# Altium schematic sheet Soldeerbout_P2.SchDoc: Soldeerbout
size A4; DrawnBy: Boghe Tim; Revision: 01; SheetNumber: 2; SheetTotal: 5; Number: PXL2022-0001
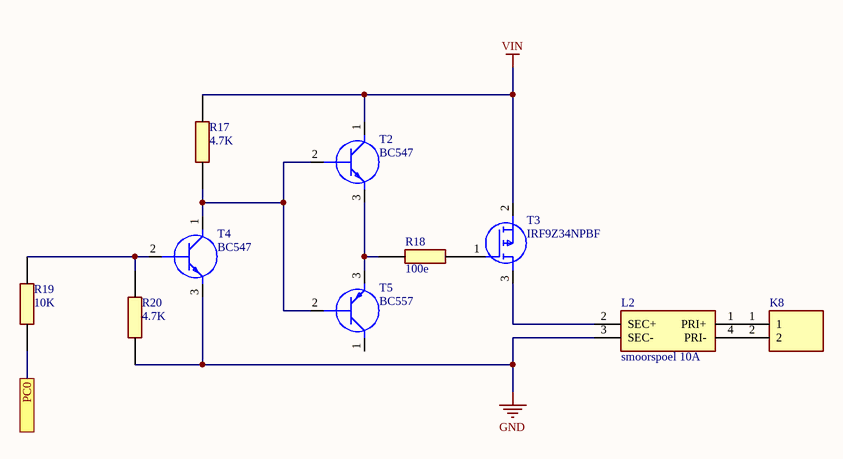
[diagram p0: Soldeerbout_P2.SchDoc]

## Parts
K8  (no value)  [K printkroonsteen 5.08]
L2  smoorspoel 10A  [CM smoorspoelen/filters 170ohm 100Mhz 10A]
R17  4.7K  [0805]
R18  100e  [0805]
R19  10K  [0805]
R20  4.7K  [0805]
T2  BC547  [T1,2,4 BC547C 45V 100mA]
T3  IRF9Z34NPBF  [T3 P-mosfet 55V 17A 0.1e]
T4  BC547  [T1,2,4 BC547C 45V 100mA]
T5  BC557  [BC557C T5 45V 100mA]

## Ports
PC0

## Nets
GND: L2.3(SEC-) R20.2 T4.3(E)
VIN: R17.1 T2.1(C) T3.2(S)
PC0: R19.2 ; port PC0
NetK8_1: K8.1 L2.1(PRI+)
NetK8_2: K8.2 L2.4(PRI-)
NetL2_2: L2.2(SEC+) T3.3(D)
NetR17_2: R17.2 T2.2(B) T4.1(C) T5.2(B)
NetR18_1: R18.1 T2.3(E) T5.3(E)
NetR18_2: R18.2 T3.1(G)
NetR19_1: R19.1 R20.1 T4.2(B)

Not connected (* = marked no-connect by the designer): T5 1(C)

## Library data of the parts
K8 = TB007-508-02BE: Connector; Manufacturer_Name: CUI Inc.; Datasheet Link: https://componentsearchengine.com//TB007-508-02BE.pdf; Height: 14mm; Mouser2 Part Number: 490-TB007-508-02BE; Mouser2 Price/Stock: https://www.mouser.com/Search/Refine.aspx?Keyword=490-TB007-508-02BE; Manufacturer_Part_Number: TB007-508-02BE
L2 = CM2545X171B-10: Transformer; Manufacturer_Name: Laird Technologies; Datasheet Link: https://datasheet.datasheetarchive.com/originals/dk/DKDS-7/122753.pdf; Height: 9.5mm; Manufacturer_Part_Number: CM2545X171B-10
R17-R20 = ESR10EZPJ183: Resistor; Manufacturer_Name: ROHM Semiconductor; Datasheet Link: https://datasheet.datasheetarchive.com/originals/distributors/Datasheets_SAMA/30ccb516c688c96e56c83a00b77a93f4.pdf; Height: 0.65mm; Manufacturer_Part_Number: ESR10EZPJ183
T2 T4 = BC547CBU: Transistor BJT NPN; Manufacturer_Name: ON Semiconductor; Datasheet Link: https://www.onsemi.com/pdf/datasheet/bc550-d.pdf; Height: 5.33mm; Manufacturer_Part_Number: BC547CBU
T3 = IRF9Z34NPBF: MOSFET (P-Channel); Manufacturer_Name: Infineon; Datasheet Link: https://componentsearchengine.com//IRF9Z34NPBF.pdf; Height: 4.69mm; Mouser2 Part Number: 942-IRF9Z34NPBF; Mouser2 Price/Stock: https://www.mouser.com/Search/Refine.aspx?Keyword=942-IRF9Z34NPBF; Manufacturer_Part_Number: IRF9Z34NPBF
T5 = BC557ATA: Transistor BJT PNP; Manufacturer_Name: ON Semiconductor; Datasheet Link: https://componentsearchengine.com//BC557ATA.pdf; Mouser2 Part Number: 512-BC557ATA; Mouser2 Price/Stock: https://www.mouser.com/Search/Refine.aspx?Keyword=512-BC557ATA; Manufacturer_Part_Number: BC557ATA